# Altium schematic sheet PowerSupply.SchDoc
size A3
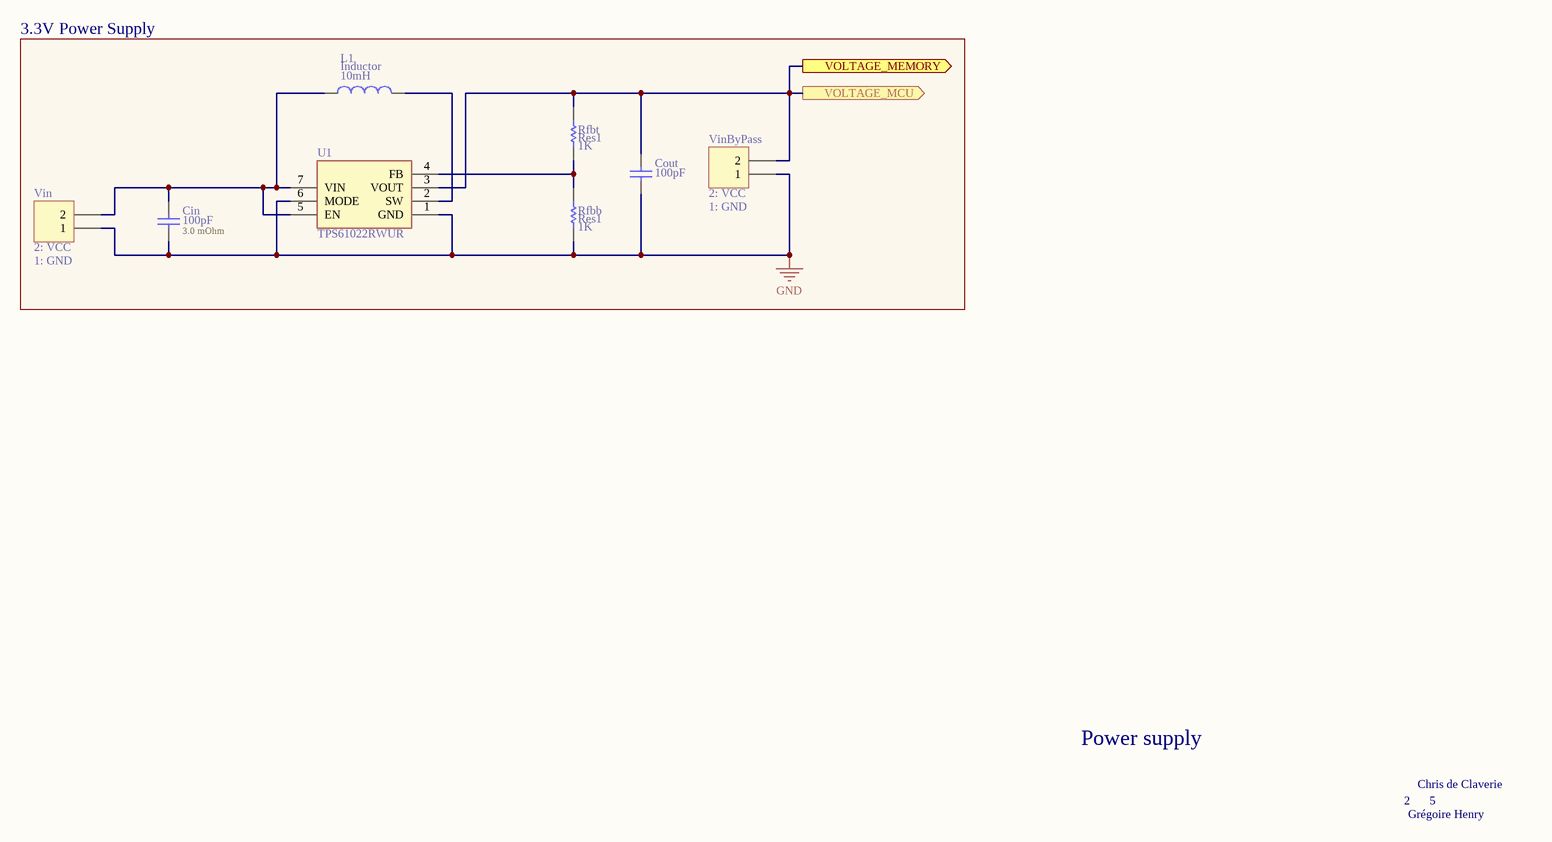
[diagram p0: PowerSupply.SchDoc]

## Parts
Cin  value 100pF  [RAD-0.3]  (hidden comment: Cap)
Cout  value 100pF  [RAD-0.3]  (hidden comment: Cap)
L1  Inductor  value 10mH  [0402-A]
Rfbb  Res1  value 1K  [AXIAL-0.3]
Rfbt  Res1  value 1K  [AXIAL-0.3]
U1  TPS61022RWUR  [TPS61022RWUR]
Vin  Header 2  [HDR1X2]  (value not drawn)
VinByPass  Header 2  [HDR1X2]  (value not drawn)

## Ports
VOLTAGE_MCU (out), VOLTAGE_MEMORY (out)

## Nets
GND: Cin.1 Cout.1 Rfbb.1 U1.1(GND) U1.6(MODE) Vin.1 VinByPass.1
VOLTAGE_MCU: Cout.2 Rfbt.2 U1.3(VOUT) VinByPass.2 ; port VOLTAGE_MCU, port VOLTAGE_MEMORY
NetCin_2: Cin.2 L1.1 U1.5(EN) U1.7(VIN) Vin.2
NetL1_2: L1.2 U1.2(SW)
NetRfbb_2: Rfbb.2 Rfbt.1 U1.4(FB)

## Notes on the sheet
- 3.3V Power Supply
- (near VinByPass) 2: VCC
- (near Vin) 2: VCC
- (near Vin) 1: GND
- (near Cin) 3.0 mOhm
- (near VinByPass) 1: GND
- Power supply
- 2
- Chris de Claverie
- 5
- Grégoire Henry

## Library data of the parts
Cin Cout = Cap: Capacitor; Published: 8-Jun-2000; LatestRevisionDate: 17-Jul-2002; LatestRevisionNote: Re-released for DXP Platform.; PackageReference: RAD-0.3; Publisher: Altium Limited; PackageDescription: Radial Cap, Thru-Hole; 2 Leads; 0.3 in Pin Spacing
L1 = Inductor: Code_IEC: 1005; Published: 8-Jun-2000; LatestRevisionDate: 29-May-2009; LatestRevisionNote: IPC-7351 Footprint Added.; PackageReference: 0402-A; Publisher: Altium Limited; PackageDescription: Chip Inductor; Code_JEITA: 0402
Rfbb Rfbt = Res1: Resistor; Published: 8-Jun-2000; LatestRevisionDate: 17-Jul-2002; LatestRevisionNote: Re-released for DXP Platform.; PackageReference: AXIAL-0.3; Publisher: Altium Limited; PackageDescription: Axial Device, Thru-Hole; 2 Leads; 0.3 in Pin Spacing
U1 = TPS61022RWUR: Power Supply; Manufacturer_Name: Texas Instruments; Datasheet Link: http://www.ti.com/lit/gpn/TPS61022; Height: 1mm; Mouser Part Number: 595-TPS61022RWUR; Mouser Price/Stock: https://www.mouser.com/Search/Refine.aspx?Keyword=595-TPS61022RWUR; Manufacturer_Part_Number: TPS61022RWUR
Vin VinByPass = Header 2: Header, 2-Pin; LatestRevisionDate: 17-Jul-2002; LatestRevisionNote: Re-released for DXP Platform.; Publisher: Altium Limited